# EAGLE design sandbox_main_v2e (EAGLE 7.7.0)
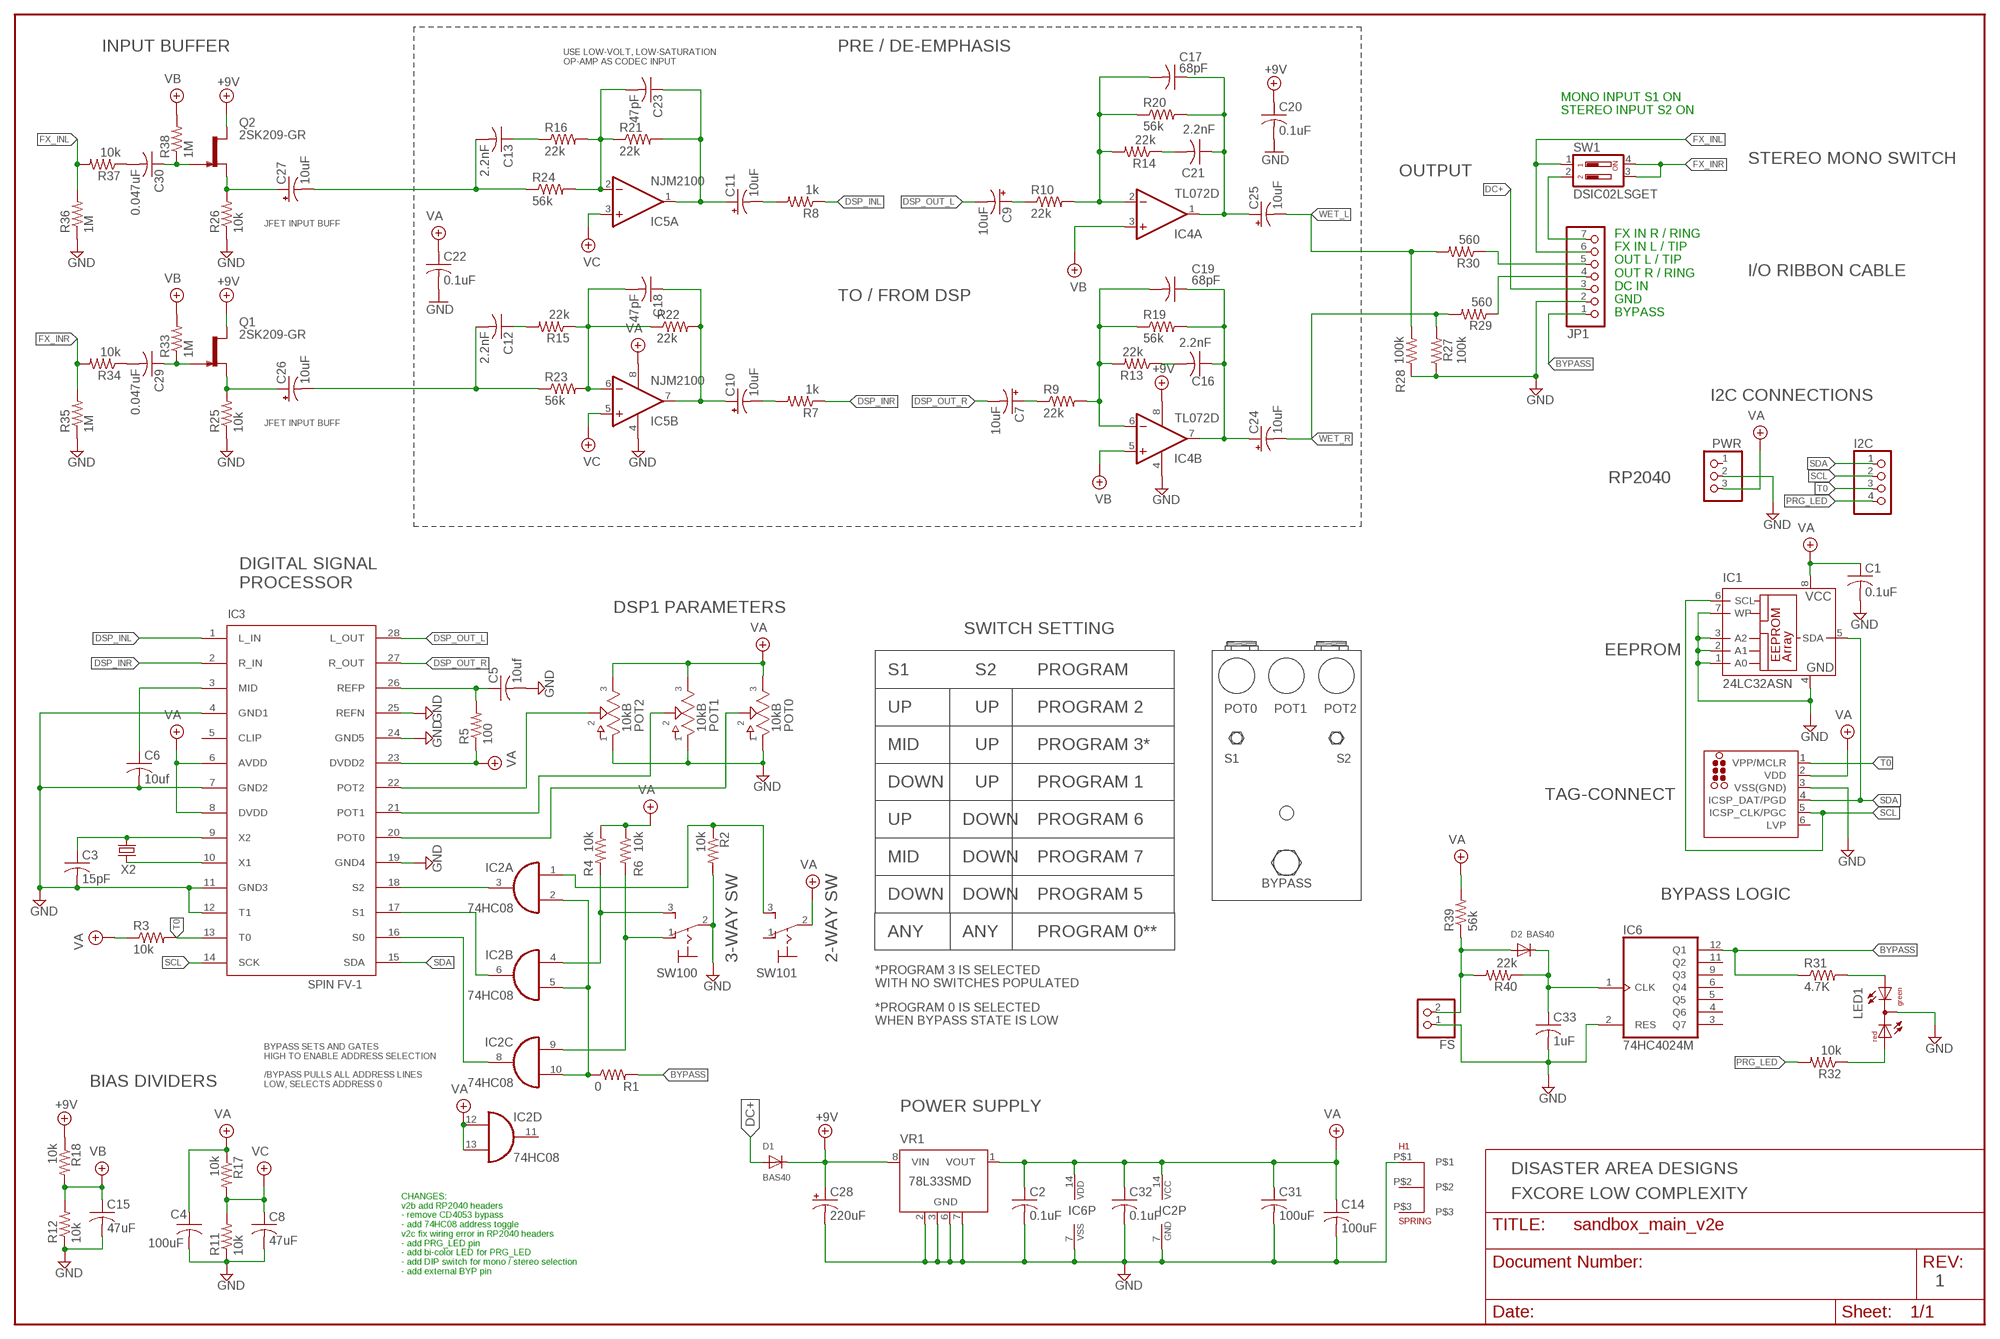
[diagram p0: schematic, sheet 1]

## Parts
C1  0.1uF  C-USC0805K  [C0805K]
C2  0.1uF  C-USC0805K  [C0805K]
C3  15pF  C-USC0805K  [C0805K]
C4  100uF  C-USC1206K  [C1206K]
C5  10uf  C-USC0805K  [C0805K]
C6  10uf  C-USC0805K  [C0805K]
C7  10uF  CPOL-USCT3216  [CT3216]
C8  47uF  C-USC1206K  [C1206K]
C9  10uF  CPOL-USCT3216  [CT3216]
C10  10uF  CPOL-USCT3216  [CT3216]
C11  10uF  CPOL-USCT3216  [CT3216]
C12  2.2nF  C-USC0805K  [C0805K]
C13  2.2nF  C-USC0805K  [C0805K]
C14  100uF  C-USC1206K  [C1206K]
C15  47uF  C-USC1206K  [C1206K]
C16  2.2nF  C-USC0805K  [C0805K]
C17  68pF  C-USC0805K  [C0805K]
C18  47pF  C-USC0805K  [C0805K]
C19  68pF  C-USC0805K  [C0805K]
C20  0.1uF  C-USC0805K  [C0805K]
C21  2.2nF  C-USC0805K  [C0805K]
C22  0.1uF  C-USC0805K  [C0805K]
C23  47pF  C-USC0805K  [C0805K]
C24  10uF  CPOL-USCT3216  [CT3216]
C25  10uF  CPOL-USCT3216  [CT3216]
C26  10uF  CPOL-USCT3216  [CT3216]
C27  10uF  CPOL-USCT3216  [CT3216]
C28  220uF  CPOL-USD  [PANASONIC_D]
C29  0.047uF  C-USC1206K  [C1206K]
C30  0.047uF  C-USC1206K  [C1206K]
C31  100uF  C-USC1206K  [C1206K]
C32  0.1uF  C-USC0805K  [C0805K]
C33  1uF  C-USC0805K  [C0805K]
D1  BAS40  DIODESOT23_REFLOW  [SOT23-R]
D2  BAS40  DIODESOT23_REFLOW  [SOT23-R]
FS  PINHD-1X2  [1X02]
H1  628  [628]
I2C  PINHD-1X4  [1X04]
IC1  24LC32ASN  [SO-08]
IC2  74HC08  74AC08D  [SO14]
IC3  SPINFV-1  [SOIC-28]
IC4  TL072D  [SO08]
IC5  NJM2100  TL072D  [SO08]
IC6  74HC4024M  4024D  [SO14]
JP1  PINHD-1X7  [1X07]
LED1  DUOLED-RG-C  [DUOLED-C-5MM]
POT0  10kB  POT_9MM_317-2080F_SM  [POT_9MM_PACK_SM]
POT1  10kB  POT_9MM_317-2080F_SM  [POT_9MM_PACK_SM]
POT2  10kB  POT_9MM_317-2080F_SM  [POT_9MM_PACK_SM]
PWR  PINHD-1X3  [1X03]
Q1  2SK209-GR  2N5457SMT  [SOT-23]
Q2  2SK209-GR  2N5457SMT  [SOT-23]
R1  0  R-US_R0805  [R0805]
R2  10k  R-US_R0805  [R0805]
R3  10k  R-US_R0805  [R0805]
R4  10k  R-US_R0805  [R0805]
R5  100  R-US_R0805  [R0805]
R6  10k  R-US_R0805  [R0805]
R7  1k  R-US_R0805  [R0805]
R8  1k  R-US_R0805  [R0805]
R9  22k  R-US_R0805  [R0805]
R10  22k  R-US_R0805  [R0805]
R11  10k  R-US_R0805  [R0805]
R12  10k  R-US_R0805  [R0805]
R13  22k  R-US_R0805  [R0805]
R14  22k  R-US_R0805  [R0805]
R15  22k  R-US_R0805  [R0805]
R16  22k  R-US_R0805  [R0805]
R17  10k  R-US_R0805  [R0805]
R18  10k  R-US_R0805  [R0805]
R19  56k  R-US_R0805  [R0805]
R20  56k  R-US_R0805  [R0805]
R21  22k  R-US_R0805  [R0805]
R22  22k  R-US_R0805  [R0805]
R23  56k  R-US_R0805  [R0805]
R24  56k  R-US_R0805  [R0805]
R25  10k  R-US_R0805  [R0805]
R26  10k  R-US_R0805  [R0805]
R27  100k  R-US_R0805  [R0805]
R28  100k  R-US_R0805  [R0805]
R29  560  R-US_R0805  [R0805]
R30  560  R-US_R0805  [R0805]
R31  4.7K  R-US_R0805  [R0805]
R32  10k  R-US_R0805  [R0805]
R33  1M  R-US_R0805  [R0805]
R34  10k  R-US_R0805  [R0805]
R35  1M  R-US_R0805  [R0805]
R36  1M  R-US_R0805  [R0805]
R37  10k  R-US_R0805  [R0805]
R38  1M  R-US_R0805  [R0805]
R39  56k  R-US_R0805  [R0805]
R40  22k  R-US_R0805  [R0805]
SW1  DSIC02LSGET  219-02  [CTS-219-02]
SW100  320-916  [320-916]
SW101  320-916  [320-916]
TC1  TC2030_ICSP-MCP-NL  [TC2030-MCP-NL]
VR1  78L33SMD  78L05SMD  [SO08]
X2  32.768kHz  CRYSTAL3.2X1.5MM  [CRYSTAL-SMD-3.2X1.5MM]

## Nets
+9V: C20.1 C28.+ D1.3(C) IC4.8(P:V+) Q1.2(D) Q2.2(D) R18.1 VR1.8(VIN)
BYPASS: IC6.12(Q1) JP1.1 R1.2 R31.1
BYPASS_IC: IC2.2(A:I1) IC2.5(B:I1) IC2.10(C:I1) R1.1
DC+: D1.1(A) JP1.3
DSP_INL: IC3.1(L_IN) R8.1
DSP_INR: IC3.2(R_IN) R7.1
DSP_OUT_L: C9.- IC3.28(L_OUT)
DSP_OUT_R: C7.- IC3.27(R_OUT)
FX_INL: JP1.6 R36.2 R37.2 SW1.1
FX_INR: R34.2 R35.2 SW1.3 SW1.4
GND: C1.2 C2.2 C3.2 C4.2 C5.2 C6.2 C8.2 C14.2 C15.2 C20.2 C22.2 C28.- C31.2 C32.2 C33.2 FS.1 H1.P$1 IC1.1(A0) IC1.2(A1) IC1.3(A2) IC1.4(GND) IC1.7(WP) IC2.7(P:GND) IC3.4(GND1) IC3.7(GND2) IC3.11(GND3) IC3.12(T1) IC3.19(GND4) IC3.24(GND5) IC3.25(REFN) IC4.4(P:V-) IC5.4(P:V-) IC6.2(RES) IC6.7(VSS) JP1.2 LED1.C POT0.P$1 POT1.P$1 POT2.P$1 PWR.2 R2.2 R11.1 R12.1 R25.1 R26.1 R27.1 R28.1 R35.1 R36.1 SW100.2(P) TC1.3(VSS(GND)) VR1.2(GND) VR1.3(GND) VR1.6(GND) VR1.7(GND)
N$1: IC3.10(X1) X2.P$1
N$2: IC2.3(A:O) IC3.18(S2)
N$3: C29.1 Q1.3(G) R33.1
N$4: IC2.6(B:O) IC3.17(S1)
N$5: C29.2 R34.1
N$6: IC2.8(C:O) IC3.16(S0)
N$7: C11.+ C23.1 IC5.1(A:OUT) R21.2
N$8: C23.2 IC5.2(A:-IN) R16.2 R21.1 R24.2
N$9: C12.2 C26.- R23.1
N$10: C12.1 R15.2
N$11: LED1.AR R32.1
N$12: JP1.7 SW1.2
N$13: C13.1 R16.1
N$14: C5.1 IC3.26(REFP) R5.2
N$15: C13.2 C27.- R24.1
N$16: C10.- R7.2
N$17: C6.1 IC3.3(MID)
N$18: C18.2 IC5.6(B:-IN) R15.1 R22.1 R23.2
N$19: C10.+ C18.1 IC5.7(B:OUT) R22.2
N$21: C17.2 IC4.2(A:-IN) R10.2 R14.2 R20.1
N$22: C11.- R8.2
N$24: C19.2 IC4.6(B:-IN) R9.2 R13.2 R19.1
N$27: C30.2 R37.1
N$28: C7.+ R9.1
N$29: C16.2 R13.1
N$30: C16.1 C19.1 C24.+ IC4.7(B:OUT) R19.2
N$31: C9.+ R10.1
N$33: JP1.5 R30.1
N$36: C21.2 R14.1
N$37: C17.1 C21.1 C25.+ IC4.1(A:OUT) R20.2
N$39: JP1.4 R29.1
N$40: C33.1 D2.3(C) IC6.1(CLK) R40.1
N$42: D2.1(A) FS.2 R39.1 R40.2
N$44: LED1.AX(AG) R31.2
N$45: C3.1 IC3.9(X2) X2.P$2
N$55: C26.+ Q1.1(S) R25.2
N$56: C27.+ Q2.1(S) R26.2
N$67: C30.1 Q2.3(G) R38.1
P0: IC3.20(POT0) POT0.P$2
P1: IC3.21(POT1) POT1.P$2
P2: IC3.22(POT2) POT2.P$2
PRG_LED: I2C.4 R32.2
S0: IC2.9(C:I0) R6.2 SW100.1(O)
S1: IC2.4(B:I0) R4.2 SW100.3(S)
S2: IC2.1(A:I0) R2.1 SW101.3(S)
SCL: I2C.2 IC1.6(SCL) IC3.14(SCK) TC1.5(ICSP_CLK/PGC)
SDA: I2C.1 IC1.5(SDA) IC3.15(SDA) TC1.4(ICSP_DAT/PGD)
T0: I2C.3 IC3.13(T0) R3.2 TC1.1(VPP/MCLR)
VA: C1.1 C2.1 C4.1 C14.1 C22.1 C31.1 C32.1 IC1.8(VCC) IC2.12(D:I0) IC2.13(D:I1) IC2.14(P:VCC) IC3.6(AVDD) IC3.8(DVDD) IC3.23(DVDD2) IC5.8(P:V+) IC6.14(VDD) POT0.P$3 POT1.P$3 POT2.P$3 PWR.3 R3.1 R4.1 R5.1 R6.1 R17.1 R39.2 SW101.2(P) TC1.2(VDD) VR1.1(VOUT)
VB: C15.1 IC4.3(A:+IN) IC4.5(B:+IN) R12.2 R18.2 R33.2 R38.2
VC: C8.1 IC5.3(A:+IN) IC5.5(B:+IN) R11.2 R17.2
WET_L: C25.- R28.2 R30.2
WET_R: C24.- R27.2 R29.2
Unconnected: H1.P$2 H1.P$3 IC2.11(D:O) IC3.5(CLIP) IC6.3(Q7) IC6.4(Q6) IC6.5(Q5) IC6.6(Q4) IC6.9(Q3) IC6.11(Q2) PWR.1 SW101.1(O) TC1.6(LVP) VR1.4(NC) VR1.5(NC)

## Notes on the sheet
- INPUT BUFFER | PRE / DE-EMPHASIS
- USE LOW-VOLT, LOW-SATURATION
  OP-AMP AS CODEC INPUT
- MONO INPUT S1 ON
  STEREO INPUT S2 ON
- STEREO MONO SWITCH
- OUTPUT
- JFET INPUT BUFF
- I/O RIBBON CABLE
- TO / FROM DSP
- FX IN R / RING
  FX IN L / TIP
  OUT L / TIP
  OUT R / RING
  DC IN
  GND
  BYPASS
- I2C CONNECTIONS
- JFET INPUT BUFF
- RP2040
- DIGITAL SIGNAL
  PROCESSOR
- DSP1 PARAMETERS
- IC3
- SWITCH SETTING
- EEPROM
- S1 | S2 | PROGRAM
- UP | UP | PROGRAM 2 | POT0 | POT1 | POT2
- MID | UP | PROGRAM 3*
- S1 | S2
- DOWN | UP | PROGRAM 1
- TAG-CONNECT
- UP | DOWN | PROGRAM 6
- MID | DOWN | PROGRAM 7
- BYPASS
- DOWN | DOWN | PROGRAM 5 | BYPASS LOGIC
- ANY | ANY | PROGRAM 0**
- 3-WAY SW | 2-WAY SW
- *PROGRAM 3 IS SELECTED
  WITH NO SWITCHES POPULATED
- SPIN FV-1
- *PROGRAM 0 IS SELECTED
  WHEN BYPASS STATE IS LOW
- BIAS DIVIDERS
- BYPASS SETS AND GATES
  HIGH TO ENABLE ADDRESS SELECTION
  
  /BYPASS PULLS ALL ADDRESS LINES
  LOW, SELECTS ADDRESS 0
- POWER SUPPLY
- DISASTER AREA DESIGNS
- FXCORE LOW COMPLEXITY
- CHANGES:
  v2b add RP2040 headers
  - remove CD4053 bypass
  - add 74HC08 address toggle
  v2c fix wiring error in RP2040 headers
  - add PRG_LED pin
  - add bi-color LED for PRG_LED
  - add DIP switch for mono / stereo selection
  - add external BYP pin
- 1

## Library data of the parts
C1-C6 C8 C12-C23 C29-C33 = rcl:C-US: CAPACITOR, American symbol
C7 C9-C11 C24-C28 = rcl:CPOL-US: POLARIZED CAPACITOR, American symbol
D1 D2 = adafruit:DIODE: Diode SMADIODE - SMA Surface Mount Package 20V 1A Schottky Diode Digikey: 641-1014-6-ND DO-1N4148 - Through Hole Small Current Diode SOD-123 20V 1 A (.5mV Vf) Schottky Diode - Digikey: MBRX120TPMSCT-ND SOD-323 10V 570mA (.38mV Vf, 3ns) Schottky Diode - Digikey: ZLLS410CT-ND SOD-523 30V 30mA Schottky Diode (RB751S-40TE61) - Digikey: RB751S-40TE61CT-ND SOT23-R/W - SOT23 Package (R = Solder Paste/Reflow Ovens, W = Hand-Soldering) BAT54Film 40V 300mA - Digikey: 497-7162-1-ND
FS = pinhead:PINHD-1X2: PIN HEADER
H1 = keystone:628
I2C = pinhead:PINHD-1X4: PIN HEADER
IC1 = microchip:24*: Serial EEPROM I2C; MF: MICROCHIP; MPN: 24LC32A/SN; OC_FARNELL: 9758003; OC_NEWARK: 33C2976
IC2 = 74xx-eu:74*08: Quad 2-input AND gate
IC3 = matt:SPINFV-1
IC4 IC5 = linear:TL072: OP AMP
IC6 = 40xx:4024: 7-stage binary/ripple COUNTER
JP1 = pinhead:PINHD-1X7: PIN HEADER
LED1 = led:DUOLED-RG-C: DUO LED 2 colors (red/green), 5 mm, round, common Cathode www.ligitek.com or other producers.
POT0 POT1 POT2 = mb_9mm Pot:POT_9MM_317-2080F
PWR = pinhead:PINHD-1X3: PIN HEADER
Q1 Q2 = gm-trans:2N5457: N-CHANNEL JFET
R1-R40 = rcl:R-US_: RESISTOR, American symbol
SW1 = switch-dil:219-02*: Surface Mount DIP Switch Series 219 SMT CTS Electronic Components Sourc: www.ctscorp.com; OC_FARNELL: unknown; OC_NEWARK: unknown
SW100 SW101 = switch:320-916: TOGGLE SWITCH distributor RS Components
TC1 = tag-connect:TC2030_ICSP: TAG-CONNECT ICSP Connector Manufacturer: Tag-Connect <http://www.tag-connect.com> Cable for easy In-Circuit Serial Programming. Designed for Microchip ICD2, suitable for many others. Two variants - one "with legs" (for hands-free fit on PCB) and another "without legs" for quick programming. PAD Description 1 MCLR/Vpp 2 Vdd 3 GND 4 PGD (ISPDAT) 5 PGC (ISPCLK) 6 nc (used for LVP) ©2009 ROFA.cz - modified and updated by Robert Darlington ‹rdarlington@gmail.com›
VR1 = linear:78L*SMD: Positive VOLTAGE REGULATOR
X2 = samd21-temp:CRYSTAL: Various standard crystals. Proven footprints.; PROD_ID: XTAL-13062

## Board
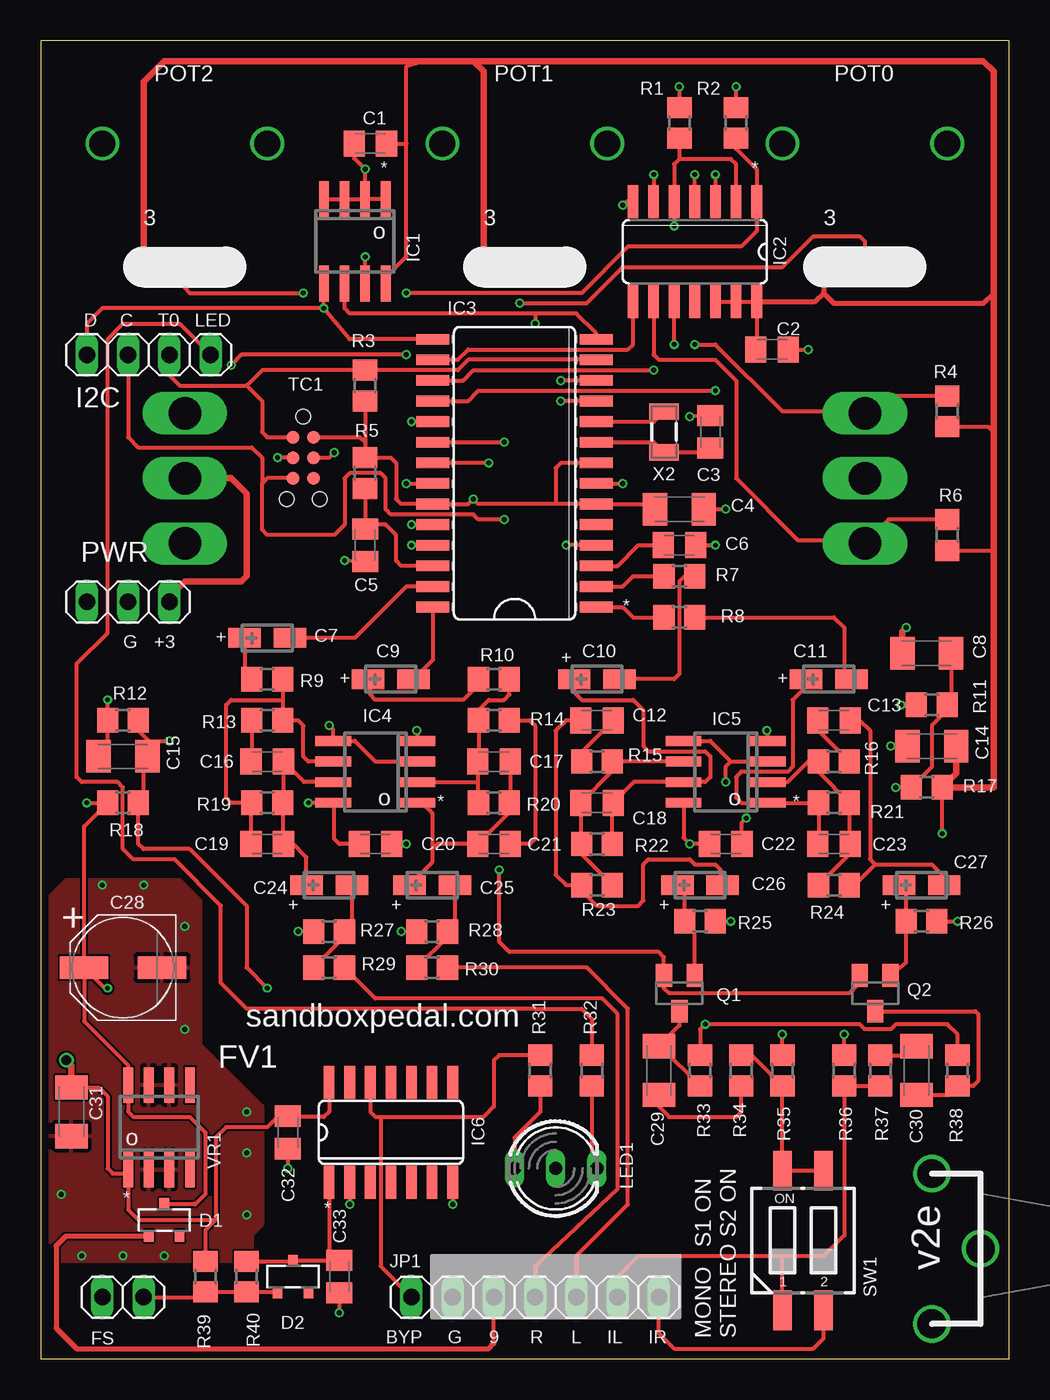
[diagram p1: board, top side]
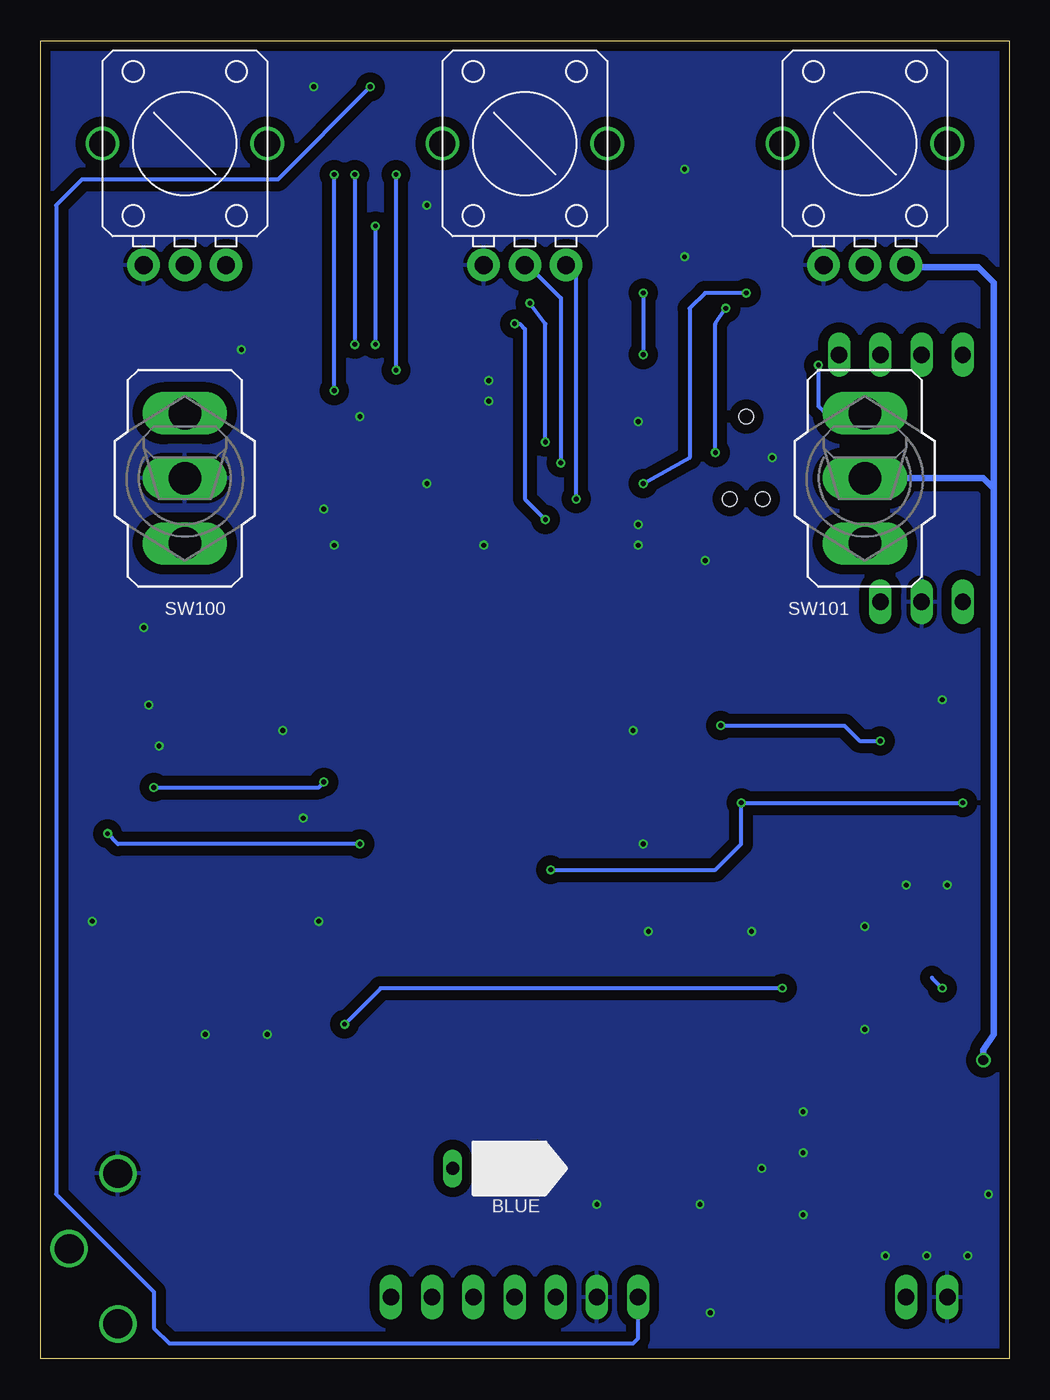
[diagram p2: board, bottom side, seen from below]

Size 59.69 x 81.28 mm. Coordinates in mm from the lower left corner, seen from the top.
Outline: 0,0 59.69,0 59.69,81.28 0,81.28 0,0
Copper layers (1*16): Top 0.035mm / dielectric 1.5mm / Bottom 0.035mm
Design rules "temp *": minimum track width 7mil, minimum drill 8mil, track to track 5mil, track to pad 5mil, pad to pad 5mil, via to via 5mil, smd to smd 0mil, copper to edge 10mil, drill to drill 8mil, minimum pad ring 7mil, minimum via ring 5mil, stop-mask expansion 2mil, vias tented up to drill 20mil, thermal gap 10mil

### Footprints (pad centres in the part's own frame; a part is rotated, then mirrored left to right if it is on the bottom)
C0805K = smd 1.3 x 1.6: 1 -1,0; 2 1,0
C1206K = smd 1.5 x 2: 1 -1.5,0; 2 1.5,0
CT3216 = smd 2 x 1.2: + -1.4,0; - 1.4,0
PANASONIC_D = smd 3 x 1.4: + 2.4,0; - -2.4,0
SOT23-R = smd 0.6 x 0.7: 1 -0.95,-1; 2 0.95,-1; 3 0,1
1X02 = drill 1.016 long: 1 -1.27,0; 2 1.27,0
628 = drill 1.778: P$1 0,0; P$2 9.271,0; P$3 4.636,2.997
1X04 = drill 1.016 long: 1 -3.81,0; 2 -1.27,0; 3 1.27,0; 4 3.81,0
SO-08 = smd 0.6 x 2.2: 1 -1.905,-2.6; 2 -0.635,-2.6; 3 0.635,-2.6; 4 1.905,-2.6; 5 1.905,2.6; 6 0.635,2.6; 7 -0.635,2.6; 8 -1.905,2.6
SO14 = smd 0.66 x 2.032: 1 -3.81,-3.073; 2 -2.54,-3.073; 3 -1.27,-3.073; 4 0,-3.073; 5 1.27,-3.073; 6 2.54,-3.073; 7 3.81,-3.073; 8 3.81,3.073; 9 2.54,3.073; 10 1.27,3.073; 11 0,3.073; 12 -1.27,3.073; 13 -2.54,3.073; 14 -3.81,3.073
SOIC-28 = smd 0.66 x 2.032: 1 -8.255,-5.029; 2 -6.985,-5.029; 3 -5.715,-5.029; 4 -4.445,-5.029; 5 -3.175,-5.029; 6 -1.905,-5.029; 7 -0.635,-5.029; 8 0.635,-5.029; 9 1.905,-5.029; 10 3.175,-5.029; 11 4.445,-5.029; 12 5.715,-5.029; 13 6.985,-5.029; 14 8.255,-5.029; 15 8.255,5.029; 16 6.985,5.029; 17 5.715,5.029; 18 4.445,5.029; 19 3.175,5.029; 20 1.905,5.029; 21 0.635,5.029; 22 -0.635,5.029; 23 -1.905,5.029; 24 -3.175,5.029; 25 -4.445,5.029; 26 -5.715,5.029; 27 -6.985,5.029; 28 -8.255,5.029
SO08 = smd 0.6 x 2.2: 1 -1.905,-2.6; 2 -0.635,-2.6; 3 0.635,-2.6; 4 1.905,-2.6; 5 1.905,2.6; 6 0.635,2.6; 7 -0.635,2.6; 8 -1.905,2.6
1X07 = drill 1.016 long: 1 -7.62,0; 2 -5.08,0; 3 -2.54,0; 4 0,0; 5 2.54,0; 6 5.08,0; 7 7.62,0
DUOLED-C-5MM = drill 0.813 long: AR 2.54,0; AX -2.54,0; C 0,0
POT_9MM_PACK_SM = drill 1.6: MT1 -5.08,0; MT2 5.08,0 | drill 1.1 pad 2: P$1 2.54,-7.493; P$2 0,-7.493; P$3 -2.54,-7.493
1X03 = drill 1.016 long: 1 -2.54,0; 2 0,0; 3 2.54,0
SOT-23 = smd 1 x 1.4: 1 -0.95,-1.1; 2 0.95,-1.1; 3 0,1.1
R0805 = smd 1.3 x 1.5: 1 -0.95,0; 2 0.95,0
CTS-219-02 = smd 1.13 x 2.44: 1 -1.27,-4.3; 2 1.27,-4.3; 3 1.27,4.3; 4 -1.27,4.3
320-916 = drill 2.007 long: 1 0,4.013; 2 0,0; 3 0,-4.013
TC2030-MCP-NL = smd 0.787 x 0.787: 1 1.27,-0.635; 2 1.27,0.635; 3 2.54,-0.635; 4 2.54,0.635; 5 3.81,-0.635; 6 3.81,0.635 | hole 0.889: 0,0; 5.08,-1.016; 5.08,1.016
CRYSTAL-SMD-3.2X1.5MM = smd 1 x 1.8: P$1 -1.25,0; P$2 1.25,0

### Placement (x,y rotation side)
C1  20.32,74.93 180 top
C2  45.09,62.23 0 top
C3  41.27,57.15 90 top
C4  39.37,52.39 0 top
C5  20,50.16 270 top
C6  39.37,50.16 0 top
C7  13.97,44.45 0 top
C8  54.61,43.5 180 top
C9  21.59,41.91 0 top
C10  34.29,41.91 0 top
C11  48.58,41.91 0 top
C12  34.29,39.37 180 top
C13  48.9,39.37 0 top
C14  54.93,37.78 180 top
C15  5.08,37.15 180 top
C16  13.97,36.83 180 top
C17  27.94,36.83 180 top
C18  34.29,34.29 180 top
C19  13.97,31.75 180 top
C20  20.64,31.75 0 top
C21  27.94,31.75 0 top
C22  42.23,31.75 0 top
C23  48.9,31.75 0 top
C24  17.78,29.21 0 top
C25  24.13,29.21 0 top
C26  40.64,29.21 0 top
C27  54.29,29.21 0 top
C28  5.08,24.13 180 top
C29  38.1,17.78 270 top
C30  53.98,17.78 90 top
C31  1.91,15.24 270 top
C32  15.24,13.97 270 top
C33  18.41,5.08 270 top
D1  7.62,8.57 0 top
D2  15.56,5.08 0 top
FS  5.08,3.81 0 top
H1  54.93,11.43 270 top
I2C  6.67,61.91 0 top
IC1  19.37,68.9 180 top
IC2  40.32,68.26 180 top
IC3  29.21,54.61 90 top
IC4  20.64,36.2 90 top
IC5  42.23,36.2 90 top
IC6  21.59,13.97 0 top
JP1  30.48,3.81 0 top
LED1  31.75,11.75 0 top
POT0  50.8,74.93 0 top
POT1  29.84,74.93 0 top
POT2  8.89,74.93 0 top
PWR  5.4,46.67 0 top
Q1  39.37,22.54 180 top
Q2  51.44,22.54 180 top
R1  39.37,76.2 90 top
R2  42.86,76.2 90 top
R3  20,60.01 90 top
R4  55.88,58.42 90 top
R5  20,54.61 270 top
R6  55.88,50.8 90 top
R7  39.37,48.26 0 top
R8  39.37,45.72 0 top
R9  13.97,41.91 0 top
R10  27.94,41.91 0 top
R11  54.93,40.32 0 top
R12  5.08,39.37 0 top
R13  13.97,39.37 0 top
R14  27.94,39.37 180 top
R15  34.29,36.83 180 top
R16  48.9,36.83 180 top
R17  54.61,35.24 180 top
R18  5.08,34.29 0 top
R19  13.97,34.29 0 top
R20  27.94,34.29 0 top
R21  48.9,34.29 180 top
R22  34.29,31.75 0 top
R23  34.29,29.21 0 top
R24  48.9,29.21 180 top
R25  40.64,26.99 180 top
R26  54.29,26.99 180 top
R27  17.78,26.35 0 top
R28  24.13,26.35 0 top
R29  17.78,24.13 180 top
R30  24.13,24.13 180 top
R31  30.8,17.78 270 top
R32  33.97,17.78 90 top
R33  40.64,17.78 90 top
R34  43.18,17.78 90 top
R35  45.72,17.78 270 top
R36  49.53,17.78 270 top
R37  51.75,17.78 270 top
R38  56.52,17.78 90 top
R39  10.16,5.08 90 top
R40  12.7,5.08 270 top
SW1  46.99,7.3 0 top
SW100  50.8,54.29 180 bottom
SW101  8.89,54.29 180 bottom
TC1  16.19,58.1 270 top
VR1  7.3,14.29 0 top
X2  38.42,57.15 270 top

### Tracks (layer width: path | path; a pad name or v marks a point on that pad's centre or on a via)
+9V  (via drill 0.3)
  Top 0.254: C28.+ 2.68,32.84 R18.1 | 3.58,33.74 R18.1 | C28.+ 2.68,20.82 5.4,18.1 VR1.8 5.4,15.24 5.71,14.92 9.21,14.92 10.16,13.97 10.16,10.16 9.53,9.53 9.48,9.57 D1.3 | v4.13,22.86 3.95,22.86 C28.+ | C20.1 18.41,31.75 18.1,32.07 18.1,34.23 IC4.8 v16.51,34.29 | v2.86,34.29 R18.1 | Q2.2 50.48,23.18 49.85,22.54 38.73,22.54 38.42,22.86 Q1.2 38.42,24.76 38.1,25.08 28.89,25.08 28.26,25.72 v28.26,30.16
  Bottom 0.254: 4.76,23.5 v4.13,22.86 | v2.86,34.29 v16.51,34.29 16.51,31.75 18.1,30.16 v28.26,30.16
BYPASS  (via drill 0.3)
  Top 0.254: IC6.12 20.32,15.24 20.64,14.92 20.95,14.92 | 20.95,14.92 27.3,14.92 27.94,15.56 27.94,18.41 28.25,18.73 R31.1 | 20.95,14.92 20.95,5.71 JP1.1 | v39.37,78.42 R1.2
  Bottom 0.254: JP1.1 22.86,1.27 23.18,0.95 51.75,0.95 52.7,1.91 52.7,4.13 58.74,10.16 58.74,71.12 57.15,72.71 45.09,72.71 v39.37,78.42
BYPASS_IC  (via drill 0.3)
  Top 0.254: IC2.2 42.86,73.66 42.55,73.98 39.37,73.98 | 39.37,73.98 39.05,73.66 IC2.5 v39.05,69.85 | R1.1 39.37,73.98 | v39.05,62.55 IC2.10
  Bottom 0.254: v39.05,69.85 v39.05,62.55
DC+
  Top 0.254: 27.94,0.95 JP1.3
  Top 0.305: D1.1 1.54,7.57 0.95,6.99 0.95,1.91 2.22,0.64 27.62,0.64 27.94,0.95
DSP_INL
  Top 0.254: IC3.1 35.88,46.35 36.51,45.72 R8.1
DSP_INR
  Top 0.254: IC3.2 35.88,47.62 36.51,48.26 R7.1
DSP_OUT_L
  Top 0.254: C9.- 24.18,43.1 IC3.28
DSP_OUT_R
  Top 0.254: IC3.27 22.54,47.62 19.37,44.45 C7.-
FX_INL
  Top 0.254: R37.2 R36.2 49.53,7.62 48.26,6.35 45.72,6.35 | 45.72,6.35 36.83,6.35 35.56,5.08 JP1.6 | SW1.1 45.72,6.35
FX_INR
  Top 0.254: R34.2 43.82,18.73 R35.2 SW1.4 SW1.3
GND  (via drill 0.3)
  Top 0.254: TC1.3 v14.61,55.56 | IC3.19 v22.86,57.78 | IC3.24 v22.86,51.44 | IC3.25 v22.86,50.16 | C5.2 19.41,49.16 v18.73,49.21 | IC1.4 IC1.3 IC1.2 | IC1.1 IC1.2 | IC1.2 v20,73.34 19.32,74.03 C1.2 | IC1.7 v20,67.94 | IC3.12 v32.07,60.33 | C3.2 40.91,58.15 v40.01,58.1 | IC3.11 v32.07,59.05 | IC3.7 v35.88,53.98 | IC3.4 v32.38,50.16 | C6.2 v41.59,50.16 | C4.2 v42.23,52.39 | R2.2 v42.86,78.42 | C2.2 v47.31,62.23 | IC6.2 v19.05,9.53 | IC6.7 v25.4,9.53 | C32.2 v15.24,11.75 | R36.1 v49.53,20 | R25.1 v42.55,26.99 | R26.1 v56.52,26.99 | IC4.4 23.24,38.67 v23.18,38.73 | C20.2 v22.54,31.75 | R28.1 v22.23,26.35 | R27.1 v15.88,26.35 | IC2.7 36.09,71.34 v35.88,71.12 | C22.2 43.23,33.07 v43.5,33.34 | IC5.4 44.83,38.67 v44.77,38.73 | R35.1 v45.72,20 | C15.2 3.81,36.83 4.13,37.15 R12.1 v4.13,40.64 | C33.2 v18.41,2.86
  Top 0.406: C8.2 53.11,44.85 v53.34,45.09 | R11.1 v53.02,40.32 | C14.2 v52.39,37.78
  other vias: 12.7,8.89 2.54,6.35 5.08,6.35 7.62,6.35 1.27,10.16 12.7,15.24 12.7,12.7 8.89,20.32 8.89,26.67 6.35,29.21 3.81,29.21
  pour Bottom (isolate 0.61): 0,81.28 59.69,81.28 59.37,0.32 -0.32,0.32
  pour Top: 0.64,6.03 0.64,28.57 1.59,29.53 8.57,29.53 9.84,28.26 9.84,19.37 13.65,15.56 13.65,8.26 13.02,7.62 13.02,6.03
N$1
  Top 0.254: IC3.10 37.8,57.78 X2.P$1
N$2  (via drill 0.3)
  Top 0.254: IC3.18 26.35,59.05 26.99,59.69 v41.59,59.69 | v41.59,73.03 IC2.3
  Bottom 0.254: v41.59,59.69 v41.59,73.03
N$3
  Top 0.254: R33.1 38.19,19.28 C29.1 39.37,20.55 Q1.3
N$4  (via drill 0.3)
  Top 0.254: IC3.17 26.04,60.33 26.67,60.96 v37.78,60.96 | v37.78,73.03 IC2.6
  Bottom 0.254: v37.78,60.96 v37.78,73.03
N$5
  Top 0.254: C29.2 38.1,15.56 38.73,14.92 42.86,14.92 43.18,15.24 R34.1
N$6
  Top 0.254: IC3.16 25.72,61.59 26.35,62.23 36.2,62.23 36.51,62.55 IC2.8
N$7
  Top 0.254: C23.1 47.95,31.8 R21.2 IC5.1 43.18,34.29 42.86,34.61 42.86,35.88 43.18,36.2 46.04,36.2 46.35,36.51 46.35,40.64 47.18,41.46 C11.+
N$8
  Top 0.254: IC5.2 46.04,35.56 47.31,36.83 R16.2 47.95,36.19 R21.1 49.84,31.8 C23.2 49.9,31.16 R24.2
N$9
  Top 0.254: C26.- 41.91,29.34 41.91,30.16 41.59,30.48 40.32,30.48 40.01,30.8 37.47,30.8 37.15,30.48 37.15,28.26 36.83,27.94 34.29,27.94 33.34,28.89 R23.1 32.38,29.21 31.75,29.84 31.75,38.73 32.38,39.37 C12.2
N$10
  Top 0.254: R15.2 33.34,37.42 C12.1
N$11
  Top 0.254: R32.1 33.97,12.06 LED1.AR
N$12
  Top 0.254: SW1.2 48.26,1.27 47.62,0.64 39.05,0.64 38.1,1.59 JP1.7
N$13
  Top 0.254: C13.1 47.9,38.78 R16.1
N$14
  Top 0.254: IC3.26 22.23,48.9 21.91,49.21 21.91,50.8 21.27,51.44 20.05,51.44 C5.1 R5.2
N$15
  Top 0.254: R24.1 50.16,29.21 51.44,30.48 | 51.44,30.48 54.93,30.48 55.56,29.84 55.56,29.34 C27.- | C13.2 50.48,39.37 51.12,38.73 51.12,30.8 51.44,30.48
N$16
  Top 0.254: R7.2 39.69,48.26 39.37,47.94 39.37,42.23 39.05,41.91 C10.-
N$17
  Top 0.254: IC3.3 35.56,48.9 36.83,50.16 C6.1
N$18
  Top 0.254: IC5.6 R15.1 35.24,36.24 C18.2 33.29,31.8 R22.1 33.34,31.11 R23.2
N$19
  Top 0.254: R22.2 35.24,34.24 C18.1 36.56,35.56 IC5.7 40.96,35.56 41.27,35.88 41.27,37.15 40.96,37.47 37.47,37.47 37.15,37.78 37.15,40.01 36.51,40.64 33.34,40.64 32.89,41.09 C10.+
N$21
  Top 0.254: R14.2 | R14.2 26.99,36.88 C17.2 26.94,35.56 | 26.94,35.56 26.94,34.34 R20.1 | IC4.2 26.94,35.56 | R14.2 26.99,40.01 27.62,40.64 28.57,40.64 28.89,40.96 R10.2
N$22
  Top 0.254: R8.2 48.9,45.72 49.53,45.09 49.53,42.04 C11.-
N$24
  Top 0.254: IC4.6 16.51,36.83 16.19,37.15 16.19,39.05 15.88,39.37 R13.2 14.92,40.64 | C19.2 12.97,34.24 R19.1 11.75,34.29 11.43,34.61 11.43,40.32 11.75,40.64 14.92,40.64 | R9.2 14.92,40.64
N$27
  Top 0.254: R37.1 53.42,18.73 C30.2
N$28
  Top 0.254: C7.+ 12.57,42.36 R9.1
N$29
  Top 0.254: R13.1 13.02,36.88 C16.2
N$30
  Top 0.254: IC4.7 16.24,35.56 C16.1 14.97,34.34 R19.2 14.92,31.8 C19.1 15.56,31.75 16.38,30.93 C24.+
N$31
  Top 0.254: R10.1 26.99,41.59 26.04,40.64 20.64,40.64 20.32,40.96 20.32,41.78 C9.+
N$33
  Top 0.254: R30.1 33.66,24.13 36.2,21.59 36.2,9.53 33.02,6.35 JP1.5
N$36
  Top 0.254: R14.1 30.16,39.37 30.48,39.05 30.48,32.07 30.16,31.75 C21.2
N$37
  Top 0.254: IC4.1 23.5,34.29 24.13,33.66 24.13,31.43 | 24.13,31.43 24.13,30.61 C25.+ | 24.13,31.43 24.45,31.75 C21.1 28.89,33.7 R20.2 28.94,34.34 C17.1
N$39
  Top 0.254: R29.1 20.64,22.23 34.61,22.23 35.56,21.27 35.56,10.48 30.48,5.71 JP1.4
N$40
  Top 0.254: R40.1 15.56,6.03 D2.3 C33.1 17.78,6.71 IC6.1
N$42
  Top 0.254: FS.2 9.84,3.81 R39.1 R40.2 14.61,4.13 D2.1
N$44
  Top 0.254: R31.2 30.8,15.24 29.21,13.65 LED1.AX
N$45
  Top 0.254: IC3.9 37.8,56.52 X2.P$2 41.02,55.9 C3.1
N$55
  Top 0.254: Q1.1 40.32,26.36 R25.2 39.69,28.76 C26.+
N$56
  Top 0.254: Q2.1 53.34,24.44 R26.2 53.34,29.08 C27.+
N$67
  Top 0.254: C30.1 55.97,16.28 R38.1 57.47,16.83 57.78,17.14 57.78,21.27 57.62,21.44 Q2.3
P0  (via drill 0.3)
  Top 0.254: IC3.20 v28.57,56.52 | v29.53,65.09 33.66,65.09 35.88,67.31 45.72,67.31 47.62,69.22 50.48,69.22 50.8,68.9 POT0.P$2
  Bottom 0.254: v28.57,56.52 28.57,63.82 v29.53,65.09
P1  (via drill 0.3)
  Top 0.254: v27.62,55.24 IC3.21
  Bottom 0.254: POT1.P$2 29.65,67.44 27.62,65.41 v27.62,55.24
P2  (via drill 0.3)
  Top 0.254: POT2.P$2 8.89,66.04 9.21,65.72 v16.19,65.72 | v22.54,53.98 IC3.22
  Bottom 0.254: v16.19,65.72 18.73,65.72 19.68,64.77 19.68,55.56 v22.54,53.98
PRG_LED
  Top 0.254: I2C.4 8.57,63.82 5.08,63.82 4.13,62.87 4.13,44.77 2.22,42.86 2.22,35.88 2.54,35.56 4.76,35.56 5.08,35.24 5.08,31.43 5.71,30.8 8.26,30.8 11.11,27.94 11.11,23.18 12.7,21.59 30.16,21.59 30.48,21.59 33.34,21.59 33.97,20.95 R32.2
S0
  Top 0.254: IC2.9 37.78,61.91 38.1,61.59 41.59,61.59 42.86,60.33 42.86,54.29 46.67,50.48 50.6,50.48 SW100.1 52.27,51.75 R6.2
S1  (via drill 0.3)
  Top 0.254: R4.2 51.86,59.37 SW100.3 50.8,58.42 45.72,58.42 41.59,62.55 v40.32,62.55 | IC2.4 v40.32,73.03
  Bottom 0.254: v40.32,73.03 v40.32,62.55
S2  (via drill 0.3)
  Top 0.254: R2.1 42.86,74.61 44.13,73.34 IC2.1 44.13,69.53 43.18,68.58 36.2,68.58 33.34,65.72 v22.54,65.72 | v22.54,61.91 12.38,61.91 v11.75,61.28
  Bottom 0.254: v22.54,65.72 v22.54,61.91 | v11.75,61.28 11.75,58.74 11.43,58.42 9,58.42 SW101.3
SCL  (via drill 0.3)
  Top 0.254: IC3.14 34.24,63.23 33.02,64.45 30.48,64.45 | 30.48,64.45 19.05,64.45 18.73,64.77 IC1.6 | 30.48,64.45 v30.48,63.82 | v28.57,51.75 26.99,51.75 26.67,52.07 21.59,52.07 21.27,52.39 21.27,54.29 20.95,54.61 19.05,54.61 18.73,54.29 18.73,51.44 18.1,50.8 13.97,50.8 13.65,51.12 13.65,53.98 | 13.65,53.98 13.97,54.29 TC1.5 | I2C.2 5.4,56.83 6.03,56.2 13.02,56.2 13.65,55.56 13.65,53.98
  Bottom 0.254: v30.48,63.82 30.16,63.82 29.84,63.5 29.84,53.02 v28.57,51.75
SDA  (via drill 0.3)
  Top 0.254: TC1.4 17.78,55.56 v18.1,55.88 | v17.46,64.77 IC1.5 | IC3.15 19.05,62.87 v17.46,64.77 | v17.46,64.77 3.81,64.77 2.86,63.82 I2C.1
  Bottom 0.254: v18.1,55.88 18.1,63.82 v17.46,64.77
T0
  Top 0.254: TC1.1 13.97,56.83 13.65,57.15 13.65,59.05 12.7,60.01 | IC3.13 26.35,61.59 25.72,60.96 R3.2 | 20.32,60.96 R3.2 | R3.2 13.65,60.96 | 13.65,60.96 | I2C.3 7.94,60.64 8.57,60.01 12.7,60.01 | 13.65,60.96 12.7,60.01
VA  (via drill 0.3, 0.6)
  Top 0.254: TC1.2 19.68,56.83 20,56.52 | 20,56.52 R5.1 21.59,55.56 21.91,55.24 21.91,53.02 22.23,52.7 IC3.23 26.35,52.7 v26.67,53.02 26.99,52.7 31.75,52.7 | IC1.8 21.27,66.67 22.54,67.94 22.54,74.93 | 22.54,74.93 22.54,79.69 23.5,80.01 | 31.75,52.7 IC3.6 37.55,52.7 C4.1 | IC3.8 32.07,55.24 31.75,54.93 31.75,52.7 | R3.1 20,56.52 | R6.1 58.73,49.85 58.74,49.85 | R4.1 58.42,57.47 58.74,57.15 | IC2.12 IC2.13 IC2.14 44.13,62.28 C2.1 | C31.1 3.58,16.74 4.13,16.19 4.13,11.75 4.45,11.43 5.14,11.43 VR1.1 5.4,9.21 6.03,8.57 10.79,8.57 | IC6.14 17.78,15.24 17.46,14.92 15.29,14.92 | 15.29,14.92 C32.1 | 10.79,8.57 10.16,7.94 R39.2 | 15.29,14.92 14.61,14.92 13.97,14.29 11.43,14.29 10.79,13.65 10.79,8.57 | IC5.8 39.63,32.13 v40.01,31.75 C22.1 | v55.56,32.38 R17.1 | C1.1 22.54,74.93
  Top 0.305: POT0.P$3 48.26,65.72 | 48.26,65.72 48.9,65.09 58.1,65.09 58.74,65.72 | IC2.14 47.73,65.19 48.26,65.72
  Top 0.406: C31.1 1.91,18.1 v1.59,18.41 | POT1.P$3 27.3,79.38 26.67,80.01 | 26.67,80.01 23.5,80.01 7.62,80.01 6.35,78.74 POT2.P$3 | C14.1 56.43,36.11 R17.1 58.74,35.24 58.74,49.85 58.74,57.15 58.74,65.72 58.74,79.38 58.1,80.01 26.67,80.01 | SW101.2 11.75,54.29 12.7,53.34 12.7,48.26 12.38,47.94 8.89,47.94 7.94,46.99 PWR.3
  Bottom 0.254: v26.67,53.02 26.67,66.8 POT1.P$3 | v40.01,31.75 54.93,31.75 v55.56,32.38
  Bottom 0.406: v1.59,18.41 1.59,19.05 0.95,20 0.95,53.66 | SW101.2 1.59,54.29 0.95,53.66 | POT2.P$3 6.22,67.31 1.91,67.31 0.95,66.36 0.95,53.66
VB  (via drill 0.3)
  Top 0.254: C15.1 6.12,36.74 | IC4.3 20.64,36.83 19.37,38.1 IC4.5 18.04,38.8 v17.78,39.05 | R12.2 6.03,38.74 6.67,38.1 | 6.67,38.1 v7.94,38.1 | C15.1 6.35,36.6 6.35,34.29 R18.2 6.03,31.75 6.35,31.43 9.21,31.43 12.7,27.94 12.7,24.13 v13.97,22.86 | C15.1 6.58,38.01 6.67,38.1 | R38.2 56.52,20 55.88,20.64 52.7,20.64 52.39,20.32 50.8,20.32 50.48,20.64 v40.96,20.64 40.64,20.32 R33.2
  Bottom 0.254: v17.78,39.05 10.16,39.05 9.21,38.1 v7.94,38.1 | v13.97,22.86 38.73,22.86 v40.96,20.64
VC  (via drill 0.3)
  Top 0.254: C8.1 56.11,40.55 R11.2 55.88,40 54.93,39.05 54.93,36.51 R17.2 v52.7,35.24 | IC5.5 41.27,38.1 42.55,36.83 | 42.55,36.83 IC5.3 | v42.23,35.56 42.23,36.51 42.55,36.83
  Bottom 0.254: v52.7,35.24 42.55,35.24 v42.23,35.56
WET_L
  Top 0.254: C25.- 25.53,26.8 R28.2 25.08,26.03 R30.2
WET_R
  Top 0.254: C24.- 19.18,26.8 R27.2 18.73,26.03 R29.2

### Text on the board
tPlace: * | * | o | D | C | T0 | LED | * | G | +3 | + | + | + | + | o | o | * | * | + | + | + | + | + | sandboxpedal.com | FV1 | o | * | v2e | * | BYP | G | 9 | R | L | IL | IR | MONO S1 ON / STEREO S2 ON
bPlace: + | BLUE